# EAGLE schematic RW_CAN v2 (EAGLE 8.5.2)
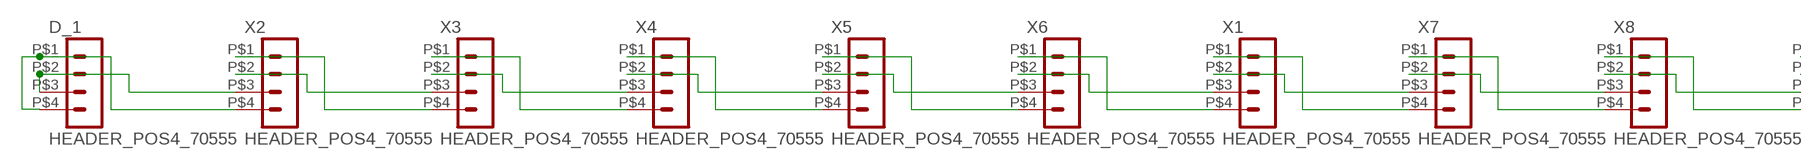
[diagram p0: schematic, sheet 1, part 1 of 2]
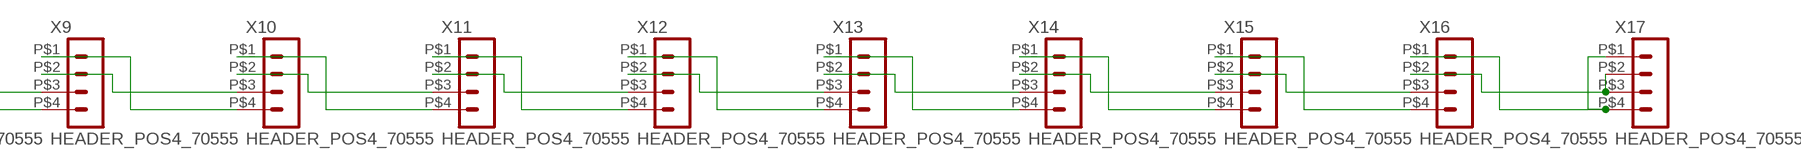
[diagram p1: schematic, sheet 1, part 2 of 2]

## Parts
D_1  HEADER_POS4_70555  [70555-POS4]
X1  HEADER_POS4_70555  [70555-POS4]
X2  HEADER_POS4_70555  [70555-POS4]
X3  HEADER_POS4_70555  [70555-POS4]
X4  HEADER_POS4_70555  [70555-POS4]
X5  HEADER_POS4_70555  [70555-POS4]
X6  HEADER_POS4_70555  [70555-POS4]
X7  HEADER_POS4_70555  [70555-POS4]
X8  HEADER_POS4_70555  [70555-POS4]
X9  HEADER_POS4_70555  [70555-POS4]
X10  HEADER_POS4_70555  [70555-POS4]
X11  HEADER_POS4_70555  [70555-POS4]
X12  HEADER_POS4_70555  [70555-POS4]
X13  HEADER_POS4_70555  [70555-POS4]
X14  HEADER_POS4_70555  [70555-POS4]
X15  HEADER_POS4_70555  [70555-POS4]
X16  HEADER_POS4_70555  [70555-POS4]
X17  HEADER_POS4_70555  [70555-POS4]

## Nets
N$5: D_1.P$1 D_1.P$4 X2.P$4
N$7: D_1.P$2 D_1.P$3 X2.P$3
N$8: X3.P$2 X4.P$3
N$9: X2.P$2 X3.P$3
N$10: X2.P$1 X3.P$4
N$11: X3.P$1 X4.P$4
N$12: X4.P$2 X5.P$3
N$13: X4.P$1 X5.P$4
N$14: X5.P$2 X6.P$3
N$15: X5.P$1 X6.P$4
N$16: X1.P$3 X6.P$2
N$17: X1.P$4 X6.P$1
N$18: X1.P$2 X7.P$3
N$19: X1.P$1 X7.P$4
N$20: X7.P$2 X8.P$3
N$21: X7.P$1 X8.P$4
N$22: X8.P$2 X9.P$3
N$23: X8.P$1 X9.P$4
N$24: X9.P$2 X10.P$3
N$25: X9.P$1 X10.P$4
N$26: X10.P$2 X11.P$3
N$27: X10.P$1 X11.P$4
N$28: X11.P$2 X12.P$3
N$29: X11.P$1 X12.P$4
N$30: X12.P$2 X13.P$3
N$31: X12.P$1 X13.P$4
N$32: X13.P$1 X14.P$4
N$33: X13.P$2 X14.P$3
N$34: X14.P$2 X15.P$3
N$35: X14.P$1 X15.P$4
N$36: X15.P$2 X16.P$3
N$37: X15.P$1 X16.P$4
N$38: X16.P$2 X17.P$2 X17.P$3
N$39: X16.P$1 X17.P$1 X17.P$4

## Library data of the parts
D_1 X1-X17 = con-molex-c-grid-sl:HEADER_POS4_?: Molex -C-Grid® / SL Series connector Wire-to-Board 2.54 mm (0.100") pitch header, 4 positions.